# Altium schematic sheet AD9851电路.SchDoc
size A4
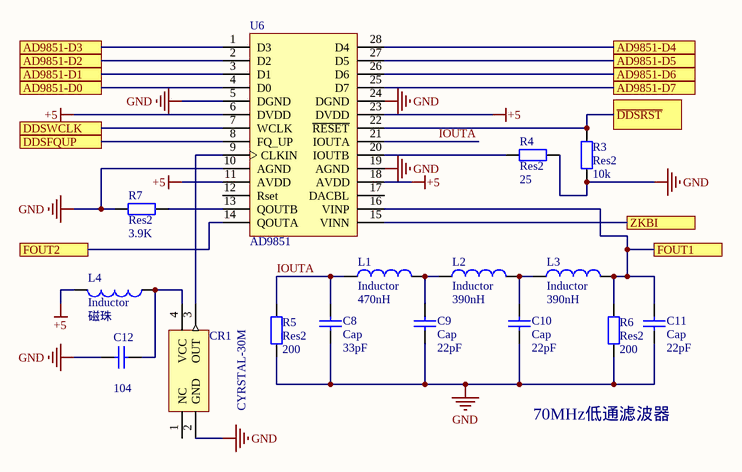
[diagram p0: AD9851电路.SchDoc]

## Parts
C8  Cap  value 33pF  [C0805]
C9  Cap  value 22pF  [C0805]
C10  Cap  value 22pF  [C0805]
C11  Cap  value 22pF  [C0805]
C12  value 104  [C0805]  (hidden comment: Cap)
CR1  CYRSTAL-30M  [CRYSTAL-SMT-5X7]
L1  Inductor  value 470nH  [6-0805_N]
L2  Inductor  value 390nH  [6-0805_N]
L3  Inductor  value 390nH  [6-0805_N]
L4  Inductor  value 磁珠  [6-0805_N]
R3  Res2  value 10k  [6-0805_N]
R4  Res2  value 25  [6-0805_N]
R5  Res2  value 200  [6-0805_N]
R6  Res2  value 200  [6-0805_N]
R7  Res2  value 3.9K  [6-0805_N]
U6  AD9851  [TSSOP28]

## Ports
AD9851-D0, AD9851-D1, AD9851-D2, AD9851-D3, AD9851-D4, AD9851-D5, AD9851-D6, AD9851-D7, DDSFQUP, DDSWCLK, FOUT1, FOUT2, ZKBI, ~{DDSRST}

## Nets
+5: L4.2 U6.6(DVDD) U6.11(AVDD) U6.18(AVDD) U6.23(DVDD)
GND: C8.1 C9.1 C10.1 C11.1 C12.2 CR1.2(GND) R3.1 R4.2 R5.1 R6.1 R7.2 U6.5(DGND) U6.10(AGND) U6.19(AGND) U6.24(DGND)
AD9851-D0: U6.4(D0) ; port AD9851-D0
AD9851-D1: U6.3(D1) ; port AD9851-D1
AD9851-D2: U6.2(D2) ; port AD9851-D2
AD9851-D3: U6.1(D3) ; port AD9851-D3
AD9851-D4: U6.28(D4) ; port AD9851-D4
AD9851-D5: U6.27(D5) ; port AD9851-D5
AD9851-D6: U6.26(D6) ; port AD9851-D6
AD9851-D7: U6.25(D7) ; port AD9851-D7
~{DDSRST}: R3.2 U6.22(~{RESET}) ; port ~{DDSRST}
DDSFQUP: U6.8(FQ_UP) ; port DDSFQUP
DDSWCLK: U6.7(WCLK) ; port DDSWCLK
FOUT1: C11.2 L3.2 R6.2 U6.16(VINP) ; port FOUT1
FOUT2: U6.14(QOUTA) ; port FOUT2
IOUTA: C8.2 L1.1 R5.2 U6.21(IOUTA)
ZKBI: U6.15(VINN) ; port ZKBI
NetC9_2: C9.2 L1.2 L2.1
NetC10_2: C10.2 L2.2 L3.1
NetC12_1: C12.1 CR1.4(VCC) L4.1
NetCR1_3: CR1.3(OUT) U6.9(CLKIN)
NetR4_1: R4.1 U6.20(IOUTB)
NetR7_1: R7.1 U6.13(QOUTB)

Not connected (* = marked no-connect by the designer): CR1 1(NC); U6 12(Rset) 17(DACBL)

## Notes on the sheet
- 70MHz低通滤波器

## Library data of the parts
C8-C12 = Cap: Capacitor; Published: 8-Jun-2000; LatestRevisionDate: 17-Jul-2002; LatestRevisionNote: Re-released for DXP Platform.; PackageReference: RAD-0.3; Publisher: Altium Limited; PackageDescription: Radial Cap, Thru-Hole; 2 Leads; 0.3 in Pin Spacing
L1-L4 = Inductor: Code_IEC: 1005; Published: 8-Jun-2000; LatestRevisionDate: 29-May-2009; LatestRevisionNote: IPC-7351 Footprint Added.; PackageReference: 0402-A; Publisher: Altium Limited; PackageDescription: Chip Inductor; Code_JEITA: 0402
R3-R7 = Res2: Resistor; Published: 8-Jun-2000; LatestRevisionDate: 17-Jul-2002; LatestRevisionNote: Re-released for DXP Platform.; PackageReference: AXIAL-0.4; Publisher: Altium Limited; PackageDescription: Axial Device, Thru-Hole; 2 Leads; 0.4 in Pin Spacing